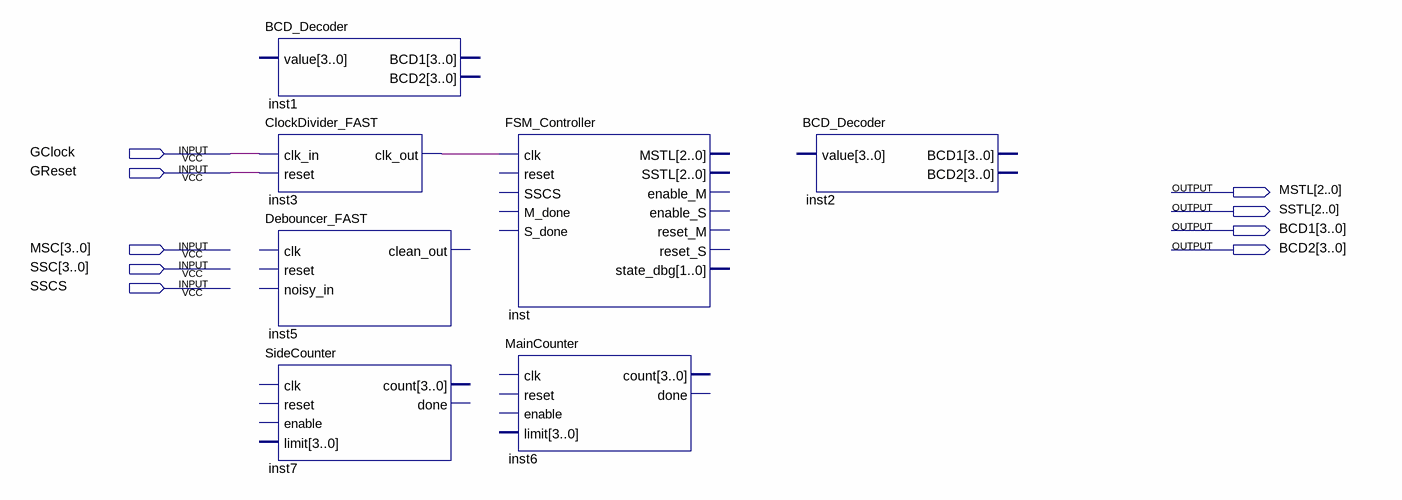
[diagram p0: schematic sheet]
// Quartus schematic top.bdf as structural Verilog: 7 symbols, 9 pins
module top (
  input  GClock,
  input  GReset,
  input  [3:0] MSC,
  input  [3:0] SSC,
  input  SSCS,
  output [2:0] MSTL,
  output [2:0] SSTL,
  output [3:0] BCD1,
  output [3:0] BCD2
);

  wire inst3_clk_out;

  BCD_Decoder inst1 ();  // open: value, BCD1, BCD2
  ClockDivider_FAST inst3 (.clk_in(GClock), .reset(GReset), .clk_out(inst3_clk_out));
  Debouncer_FAST inst5 ();  // open: clk, reset, noisy_in, clean_out
  SideCounter inst7 ();  // open: clk, reset, enable, limit, count, done
  FSM_Controller inst (.clk(inst3_clk_out));  // open: reset, SSCS, M_done, S_done, MSTL, SSTL, enable_M, enable_S, reset_M, reset_S, state_dbg
  MainCounter inst6 ();  // open: clk, reset, enable, limit, count, done
  BCD_Decoder inst2 ();  // open: value, BCD1, BCD2
endmodule
